# Altium schematic sheet Main.SchDoc: Top level
size A4; Organization: Use Organization_Name in ProjParam; Address1: Eliot Ferragni; Address2: STI-MOBOTS; Address3: EPFL; Address4: CH-1015 LAUSANNE; DocumentNumber: 1; Revision: A; SheetNumber: 1; SheetTotal: 7; ApprovedBy: Init ApprovedBy in DocParam; CheckedBy: Init CheckedBy in DocParam; Author: Init Author in DocParam; CompanyName: Init CompanyName in DocParam; DrawnBy: Init DrawBy in DocParam; Engineer: Init Engineer in DocParam; DocumentName: Init DocumentName in DocParam; ProjectName: Init ProjectName in DocParam
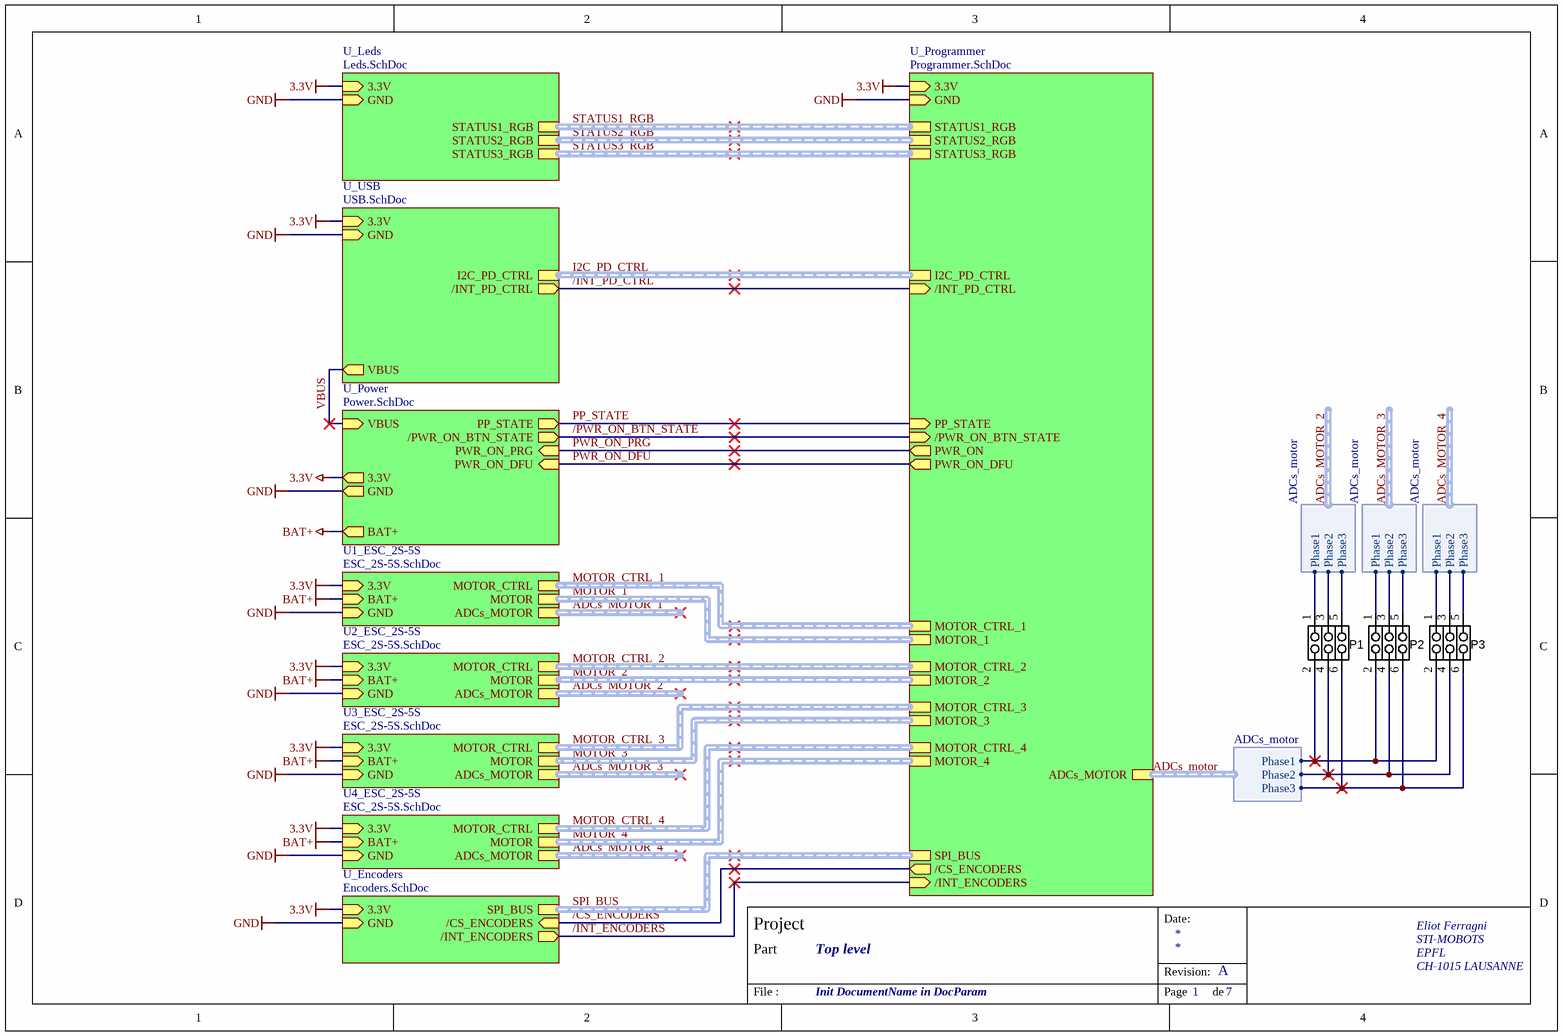
[diagram p0: Main.SchDoc]

## Parts
P1  Header 2x3 flat  [HEADER3x2-2.54]  (value not drawn)
P2  Header 2x3 flat  [HEADER3x2-2.54]  (value not drawn)
P3  Header 2x3 flat  [HEADER3x2-2.54]  (value not drawn)

## Sub-sheets
U1_ESC_2S-5S = ESC_2S-5S.SchDoc: MOTOR_CTRL (harness Brushless motor), BAT+ (in), GND (in), MOTOR (harness Motor_connection), ADCs_MOTOR (harness ADCs_motor), 3.3V (in)
U2_ESC_2S-5S = ESC_2S-5S.SchDoc: BAT+ (in), GND (in), 3.3V (in), MOTOR_CTRL (harness Brushless motor), MOTOR (harness Motor_connection), ADCs_MOTOR (harness ADCs_motor)
U3_ESC_2S-5S = ESC_2S-5S.SchDoc: BAT+ (in), GND (in), 3.3V (in), MOTOR_CTRL (harness Brushless motor), MOTOR (harness Motor_connection), ADCs_MOTOR (harness ADCs_motor)
U4_ESC_2S-5S = ESC_2S-5S.SchDoc: BAT+ (in), GND (in), 3.3V (in), MOTOR_CTRL (harness Brushless motor), MOTOR (harness Motor_connection), ADCs_MOTOR (harness ADCs_motor)
U_Encoders = Encoders.SchDoc: 3.3V (in), GND (in), SPI_BUS (harness SPI), /CS_ENCODERS (in), /INT_ENCODERS (out)
U_Leds = Leds.SchDoc: STATUS1_RGB (harness RGB), STATUS2_RGB (harness RGB), STATUS3_RGB (harness RGB), 3.3V (in), GND (in)
U_Power = Power.SchDoc: /PWR_ON_BTN_STATE (out), PP_STATE (out), VBUS (in), BAT+ (out), PWR_ON_DFU (in), PWR_ON_PRG (in), 3.3V (out), GND (out)
U_Programmer = Programmer.SchDoc: I2C_PD_CTRL (harness I2C), PP_STATE (in), /PWR_ON_BTN_STATE (in), PWR_ON (out), /INT_PD_CTRL (in), STATUS1_RGB (harness RGB), STATUS2_RGB (harness RGB), STATUS3_RGB (harness RGB), PWR_ON_DFU (out), 3.3V (in), GND (in), MOTOR_3 (harness Motor_connection), MOTOR_1 (harness Motor_connection), MOTOR_4 (harness Motor_connection), MOTOR_2 (harness Motor_connection), SPI_BUS (harness SPI), /CS_ENCODERS (out), /INT_ENCODERS (in), ADCs_MOTOR (harness ADCs_motor), MOTOR_CTRL_2 (harness Brushless motor), MOTOR_CTRL_1 (harness Brushless motor), MOTOR_CTRL_4 (harness Brushless motor), MOTOR_CTRL_3 (harness Brushless motor)
U_USB = USB.SchDoc: /INT_PD_CTRL (out), VBUS (out), I2C_PD_CTRL (harness I2C), 3.3V (in), GND (in)

## Harnesses
ADCs_motor: Phase1, Phase2, Phase3

## Nets
3.3V: sheet U_Programmer/3.3V, sheet U_Power/3.3V, sheet U_USB/3.3V, sheet U_Leds/3.3V, sheet U_Encoders/3.3V, sheet U1_ESC_2S-5S/3.3V, sheet U2_ESC_2S-5S/3.3V, sheet U3_ESC_2S-5S/3.3V, sheet U4_ESC_2S-5S/3.3V
BAT+: sheet U_Power/BAT+, sheet U1_ESC_2S-5S/BAT+, sheet U2_ESC_2S-5S/BAT+, sheet U3_ESC_2S-5S/BAT+, sheet U4_ESC_2S-5S/BAT+
GND: sheet U_Programmer/GND, sheet U_Power/GND, sheet U_USB/GND, sheet U_Leds/GND, sheet U_Encoders/GND, sheet U1_ESC_2S-5S/GND, sheet U2_ESC_2S-5S/GND, sheet U3_ESC_2S-5S/GND, sheet U4_ESC_2S-5S/GND
/CS_ENCODERS: sheet U_Programmer//CS_ENCODERS, sheet U_Encoders//CS_ENCODERS
/INT_ENCODERS: sheet U_Programmer//INT_ENCODERS, sheet U_Encoders//INT_ENCODERS
/INT_PD_CTRL: sheet U_Programmer//INT_PD_CTRL, sheet U_USB//INT_PD_CTRL
/PWR_ON_BTN_STATE: sheet U_Programmer//PWR_ON_BTN_STATE, sheet U_Power//PWR_ON_BTN_STATE
ADCs_motor.Phase1: P1.2 P2.2 P3.2 ; sheet U_Programmer/ADCs_MOTOR.Phase1
ADCs_motor.Phase2: P1.4 P2.4 P3.4 ; sheet U_Programmer/ADCs_MOTOR.Phase2
ADCs_motor.Phase3: P1.6 P2.6 P3.6 ; sheet U_Programmer/ADCs_MOTOR.Phase3
ADCs_MOTOR_2.Phase1: P1.1 ; sheet U2_ESC_2S-5S/ADCs_MOTOR.Phase1
ADCs_MOTOR_2.Phase2: P1.3 ; sheet U2_ESC_2S-5S/ADCs_MOTOR.Phase2
ADCs_MOTOR_2.Phase3: P1.5 ; sheet U2_ESC_2S-5S/ADCs_MOTOR.Phase3
ADCs_MOTOR_3.Phase1: P2.1 ; sheet U3_ESC_2S-5S/ADCs_MOTOR.Phase1
ADCs_MOTOR_3.Phase2: P2.3 ; sheet U3_ESC_2S-5S/ADCs_MOTOR.Phase2
ADCs_MOTOR_3.Phase3: P2.5 ; sheet U3_ESC_2S-5S/ADCs_MOTOR.Phase3
ADCs_MOTOR_4.Phase1: P3.1 ; sheet U4_ESC_2S-5S/ADCs_MOTOR.Phase1
ADCs_MOTOR_4.Phase2: P3.3 ; sheet U4_ESC_2S-5S/ADCs_MOTOR.Phase2
ADCs_MOTOR_4.Phase3: P3.5 ; sheet U4_ESC_2S-5S/ADCs_MOTOR.Phase3
PP_STATE: sheet U_Programmer/PP_STATE, sheet U_Power/PP_STATE
PWR_ON_DFU: sheet U_Programmer/PWR_ON_DFU, sheet U_Power/PWR_ON_DFU
PWR_ON_PRG: sheet U_Programmer/PWR_ON, sheet U_Power/PWR_ON_PRG
VBUS: sheet U_Power/VBUS, sheet U_USB/VBUS

## Buses and harness runs
harness ADCs_motor = sheet U_Programmer/ADCs_MOTOR
harness ADCs_MOTOR_1 = sheet U1_ESC_2S-5S/ADCs_MOTOR
harness ADCs_MOTOR_2 = sheet U2_ESC_2S-5S/ADCs_MOTOR
harness ADCs_MOTOR_3 = sheet U3_ESC_2S-5S/ADCs_MOTOR
harness ADCs_MOTOR_4 = sheet U4_ESC_2S-5S/ADCs_MOTOR
harness I2C_PD_CTRL = sheet U_Programmer/I2C_PD_CTRL = sheet U_USB/I2C_PD_CTRL
harness MOTOR_1 = sheet U1_ESC_2S-5S/MOTOR = sheet U_Programmer/MOTOR_1
harness MOTOR_2 = sheet U2_ESC_2S-5S/MOTOR = sheet U_Programmer/MOTOR_2
harness MOTOR_3 = sheet U3_ESC_2S-5S/MOTOR = sheet U_Programmer/MOTOR_3
harness MOTOR_4 = sheet U4_ESC_2S-5S/MOTOR = sheet U_Programmer/MOTOR_4
harness MOTOR_CTRL_1 = sheet U1_ESC_2S-5S/MOTOR_CTRL = sheet U_Programmer/MOTOR_CTRL_1
harness MOTOR_CTRL_2 = sheet U2_ESC_2S-5S/MOTOR_CTRL = sheet U_Programmer/MOTOR_CTRL_2
harness MOTOR_CTRL_3 = sheet U3_ESC_2S-5S/MOTOR_CTRL = sheet U_Programmer/MOTOR_CTRL_3
harness MOTOR_CTRL_4 = sheet U4_ESC_2S-5S/MOTOR_CTRL = sheet U_Programmer/MOTOR_CTRL_4
harness SPI_BUS = sheet U_Encoders/SPI_BUS = sheet U_Programmer/SPI_BUS
harness STATUS1_RGB = sheet U_Leds/STATUS1_RGB = sheet U_Programmer/STATUS1_RGB
harness STATUS2_RGB = sheet U_Leds/STATUS2_RGB = sheet U_Programmer/STATUS2_RGB
harness STATUS3_RGB = sheet U_Leds/STATUS3_RGB = sheet U_Programmer/STATUS3_RGB

## Notes on the sheet
- Date:
- Project
- Part
- Revision:
- File :
- Page
- de

## Library data of the parts
P1-P3 = Header 2x3 flat: LatestRevisionDate: 17-Jul-2002; LatestRevisionNote: Re-released for DXP Platform.; Publisher: Altium Limited